# Altium schematic sheet [2]- Connector_Page.SchDoc: STM Bluepill
size A; DrawnBy: Aviral Mishra; DocumentNumber: 2; Revision: V1.0; SheetNumber: 2; SheetTotal: 2; Company Name: Esteem PCB
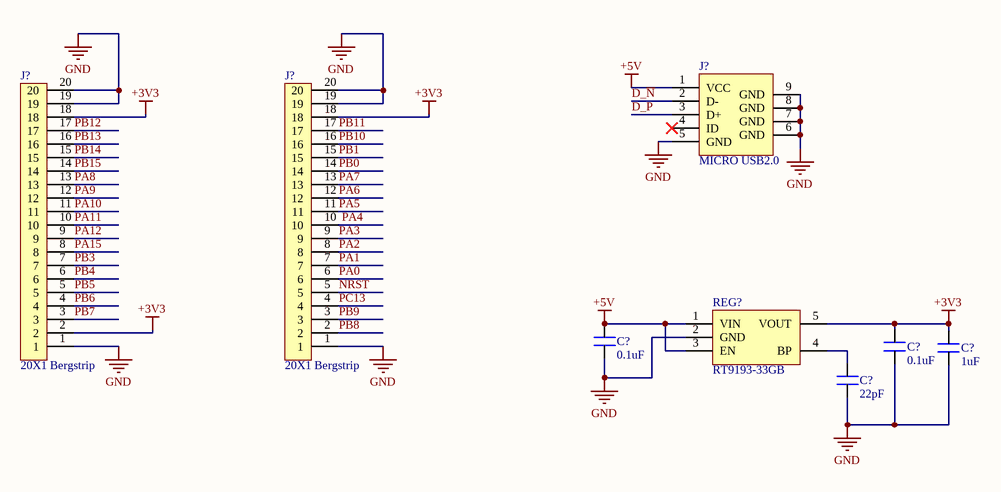
[diagram p0: [2]- Connector_Page.SchDoc]

## Parts
(Parts that share a designator on the sheet are numbered #1, #2 ... from top to bottom, then left to right.)
C?#1  0.1uF  [CAP_0805]
C?#2  0.1uF  [CAP_0805]
C?#3  1uF  [CAP_0805]
C?#4  22pF  [CAP_0805]
J?#1  MICRO USB2.0  [CON_10118192-0001LF_SMD]
J?#2  20X1 Bergstrip  [CON20_100_40D72_TH_ST]
J?#3  20X1 Bergstrip  [CON20_100_40D72_TH_ST]
REG?  RT9193-33GB  [SOT23-5]

## Nets
+3V3: C?#2.2 C?#3.2 J?#2.2 J?#2.18 J?#3.18 REG?.5(VOUT)
+5V: C?#1.2 J?#1.1(VCC) REG?.1(VIN) REG?.3(EN)
GND: C?#1.1 C?#2.1 C?#3.1 C?#4.1 J?#1.5(GND) J?#1.6(GND) J?#1.7(GND) J?#1.8(GND) J?#1.9(GND) J?#2.1 J?#2.19 J?#2.20 J?#3.1 J?#3.19 J?#3.20 REG?.2(GND)
D_~{N}: J?#1.2(D-)
D_P: J?#1.3(D+)
NRST: J?#3.5
PA0: J?#3.6
PA1: J?#3.7
PA2: J?#3.8
PA3: J?#3.9
PA4: J?#3.10
PA5: J?#3.11
PA6: J?#3.12
PA7: J?#3.13
PA8: J?#2.13
PA9: J?#2.12
PA10: J?#2.11
PA11: J?#2.10
PA12: J?#2.9
PA15: J?#2.8
PB0: J?#3.14
PB1: J?#3.15
PB3: J?#2.7
PB4: J?#2.6
PB5: J?#2.5
PB6: J?#2.4
PB7: J?#2.3
PB8: J?#3.2
PB9: J?#3.3
PB10: J?#3.16
PB11: J?#3.17
PB12: J?#2.17
PB13: J?#2.16
PB14: J?#2.15
PB15: J?#2.14
PC13: J?#3.4
NetC?#4_2: C?#4.2 REG?.4(BP)

Not connected (* = marked no-connect by the designer): J?#1 4(ID)*

## Notes on the sheet
- Company Name

## Library data of the parts
C?#1 C?#2 = CAP_0.1uF-50V-5%-0805: 0.1µF ±5% 50V Ceramic Capacitor X7R 0805 (2012 Metric); Manufacturer: KEMET; Manufacturing Part Number: C0805C104J5RACTU; Case/Package: 0805 (2012 Metric); Supplier-1: Digikey; Supplier Part Number-1: 399-1171-1-ND
C?#3 = CAP_1uF-50V-5%-0805: 1µF ±5% 50V Ceramic Capacitor X7R 0805 (2012 Metric); Manufacturer: Yageo; Manufacturing Part Number: CC0805JKX7R9BB105; Case/Package: 0805 (2012 Metric); Supplier-1: Digikey; Supplier Part Number-1: 311-3498-1-ND
C?#4 = CAP_22pF-50V-5%-0805: 22pF ±5% 50V Ceramic Capacitor C0G, NP0 0805 (2012 Metric); Manufacturer: KEMET; Manufacturer Part Number: C0805C220J5GACTU; Case/Package: 0805; Supplier-1: Digikey; Supplier Part Number-1: 399-1113-1-ND
J?#1 = CON-USB_10118192-0002LF-SMD: USB - micro B USB 2.0 Receptacle Connector 5 Position Surface Mount, Right Angle; Manufacturer: Amphenol ICC (FCI); Manufacturing Part Number: 10118192-0002LF; Case/Package: SMD; Supplier-1: Digikey; Supplier Part Number-1: 609-5379-1-ND
J?#2 J?#3 = CON-BS-PLG_20X1-100-TH-ST: 20 pin, 1 row, 2.54mm pitch bergstrip; Manufacturer: NA; Manufacturing Part Number: NA; Case/Package: TH; Supplier-1: NA; Supplier Part Number-1: NA
REG? = REG_3.3V-5.5V-0.3A-SOT-23-5: Linear Voltage Regulator IC 1 Output 300mA SOT-23-5; Manufacturer: Richtek USA Inc.; Manufacturer Part Number: RT9193-33GB; Case/ Package: SOT-23-5; Supplier-1: Digikey; Supplier Part Number-1: 1028-1014-1-ND